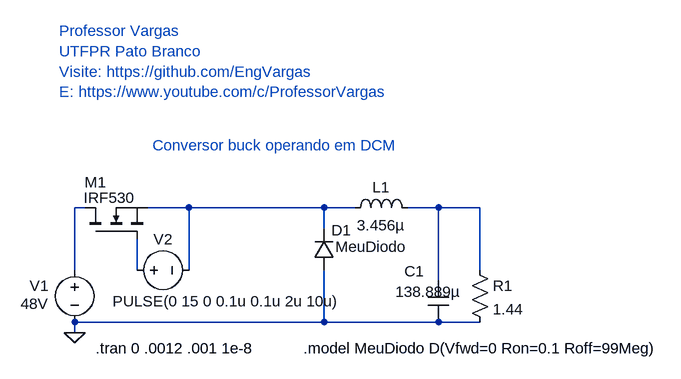
[diagram p0: schematic Conv-A03-Buck_DCM_(LTspice).asc]
Conv-A03-Buck_DCM_(LTspice).asc, the LTspice schematic file:
Version 4
SHEET 1 1072 680
WIRE 112 -64 96 -64
WIRE 272 -64 208 -64
WIRE 480 -64 272 -64
WIRE 528 -64 480 -64
WIRE 656 -64 608 -64
WIRE 720 -64 656 -64
WIRE 480 -32 480 -64
WIRE 96 32 96 -64
WIRE 192 32 192 -16
WIRE 272 32 272 -64
WIRE 720 32 720 -64
WIRE 656 48 656 -64
WIRE 480 112 480 32
WIRE 480 112 96 112
WIRE 656 112 480 112
WIRE 720 112 656 112
WIRE 96 128 96 112
FLAG 96 128 0
SYMBOL voltage 96 16 R0
WINDOW 3 -83 68 Left 2
WINDOW 0 -69 40 Left 2
SYMATTR Value 48V
SYMATTR InstName V1
SYMBOL voltage 176 32 R270
WINDOW 0 32 56 VTop 2
WINDOW 3 -32 154 VBottom 2
WINDOW 123 0 0 Left 2
WINDOW 39 0 0 Left 2
SYMATTR InstName V2
SYMATTR Value PULSE(0 15 0 0.1u 0.1u 2u 10u)
SYMBOL nmos 112 -16 R270
WINDOW 0 87 -1 VRight 2
WINDOW 3 63 -2 VRight 2
SYMATTR InstName M1
SYMATTR Value IRF530
SYMBOL ind 512 -48 R270
WINDOW 0 32 56 VTop 2
WINDOW 3 5 56 VBottom 2
SYMATTR InstName L1
SYMATTR Value 3.456µ
SYMBOL cap 640 48 R0
WINDOW 0 -36 -14 Left 2
WINDOW 3 -50 17 Left 2
SYMATTR InstName C1
SYMATTR Value 138.889µ
SYMBOL res 704 16 R0
SYMATTR InstName R1
SYMATTR Value 1.44
SYMBOL diode 496 32 R180
WINDOW 0 -26 61 Left 2
WINDOW 3 -112 36 Left 2
SYMATTR InstName D1
SYMATTR Value MeuDiodo
TEXT 128 152 Left 2 !.tran 0 .0012 .001 1e-8
TEXT 448 152 Left 2 !.model MeuDiodo D(Vfwd=0 Ron=0.1 Roff=99Meg)
TEXT 72 -336 Left 2 ;Professor Vargas\nUTFPR Pato Branco\nVisite: https://github.com/EngVargas\nE: https://www.youtube.com/c/ProfessorVargas
TEXT 216 -160 Left 2 ;Conversor buck operando em DCM

The netlist it stands for:
* Conv-A03-Buck_DCM_(LTspice).asc
V1 N001 0 48V
V2 N004 N002 PULSE(0 15 0 0.1u 0.1u 2u 10u)
M1 N001 N004 N002 N002 IRF530
L1 N002 N003 3.456µ
C1 N003 0 138.889µ
R1 N003 0 1.44
D1 0 N002 MeuDiodo
.model D D
.lib standard.dio
.model NMOS NMOS
.model PMOS PMOS
.lib standard.mos
.tran 0 .0012 .001 1e-8
.model MeuDiodo D(Vfwd=0 Ron=0.1 Roff=99Meg)
* Professor Vargas
* UTFPR Pato Branco
* Visite: https://github.com/EngVargas
* E: https://www.youtube.com/c/ProfessorVargas
* Conversor buck operando em DCM
.backanno
.end